# Altium schematic sheet RTU_LMG_CPU.SchDoc
size A2; Organization: Altium Limited; Address1: L3, 12a Rodborough Rd; Address2: Frenchs Forest; Address3: NSW; Address4: Australia 2086; SheetNumber: 2; SheetTotal: 16
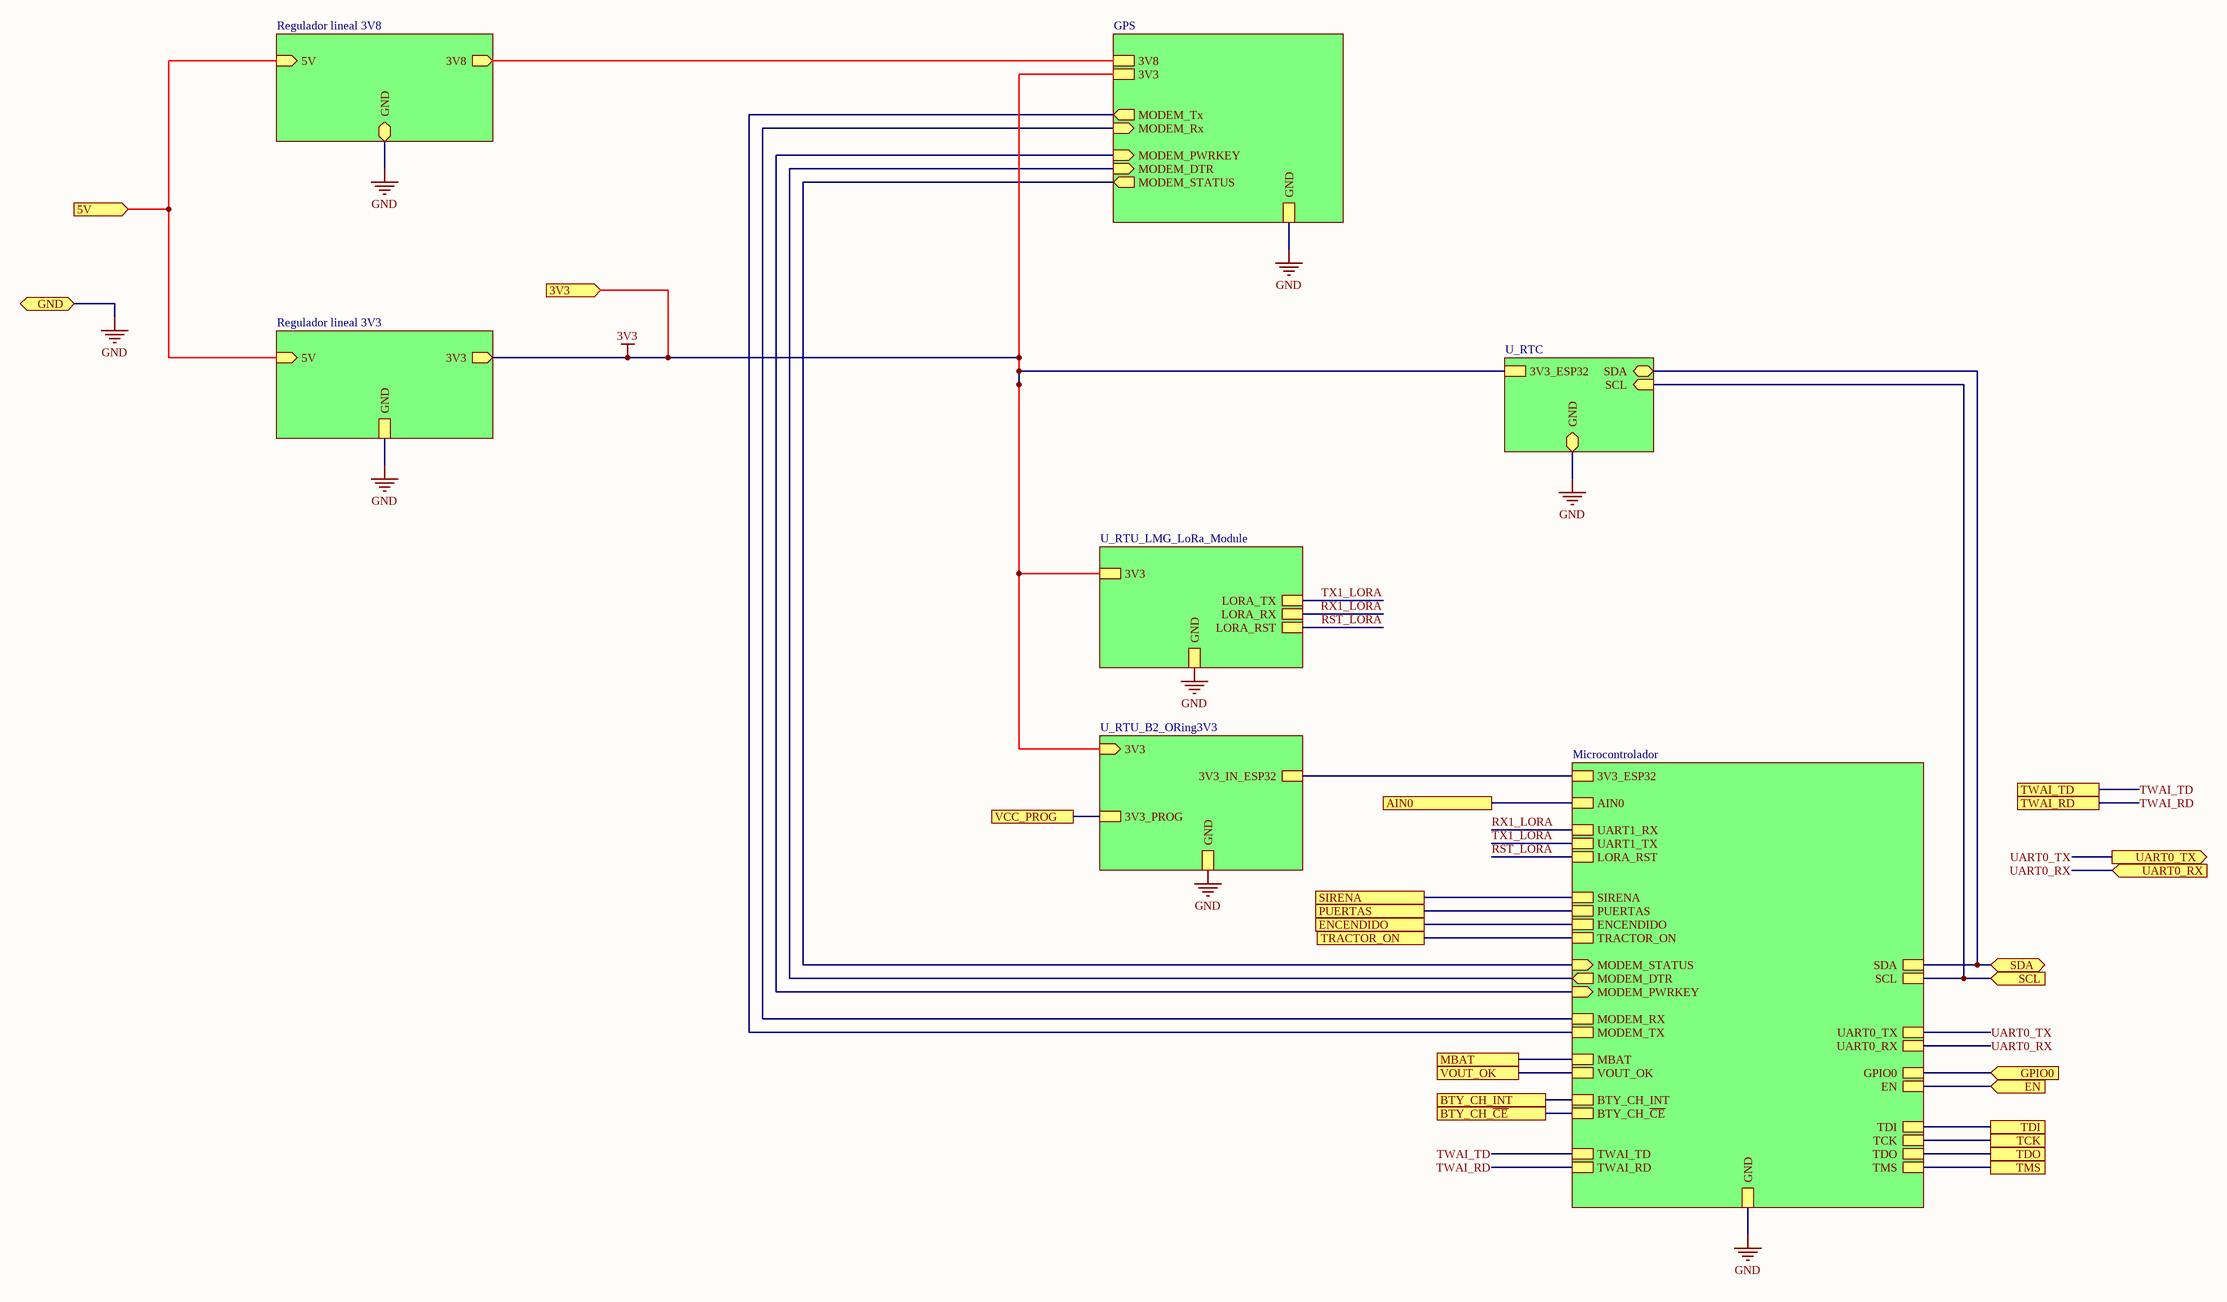
[diagram p0: RTU_LMG_CPU.SchDoc]

## Sub-sheets
GPS = RTU_LMG_Modem.SchDoc: 3V3, 3V8, GND, MODEM_Rx (in), MODEM_PWRKEY (in), MODEM_Tx (out), MODEM_DTR (in), MODEM_STATUS (out)
Microcontrolador = RTU_LMG_Microcontroller.SchDoc: MODEM_TX, EN, MODEM_RX, UART0_TX, UART0_RX, SDA, SCL, MODEM_DTR (out), MODEM_STATUS (in), GPIO0, GND, MODEM_PWRKEY (in), TDI, TCK, TDO, TMS, BTY_CH_INT, BTY_CH_~{CE}, VOUT_OK, MBAT, 3V3_ESP32, LORA_RST, UART1_TX, UART1_RX, TWAI_TD, TWAI_RD, SIRENA, PUERTAS, ENCENDIDO, TRACTOR_ON, AIN0
Regulador lineal 3V3 = RTU_LMG_Linear_Voltage_Regulator_3V3.SchDoc: GND, 3V3 (out), 5V (in)
Regulador lineal 3V8 = RTU_LMG_Linear_Voltage_Regulator_3V8.SchDoc: GND (bidir), 3V8 (out), 5V (in)
U_RTC = RTU_LMG_RTC.SchDoc: SDA (bidir), SCL (in), GND (bidir), 3V3_ESP32
U_RTU_B2_ORing3V3 = RTU_LMG_ORing3V3.SchDoc: 3V3_PROG, 3V3_IN_ESP32, GND, 3V3 (in)
U_RTU_LMG_LoRa_Module = RTU_LMG_LoRa_Module.SchDoc: LORA_RST, LORA_TX, LORA_RX, 3V3, GND

## Ports
3V3 (in), 5V (in), AIN0, BTY_CH_INT, BTY_CH_~{CE}, EN (in), ENCENDIDO, GND (bidir), GPIO0 (in), MBAT, PUERTAS, SCL (in), SDA (bidir), SIRENA, TCK, TDI, TDO, TMS, TRACTOR_ON, TWAI_RD, TWAI_TD, UART0_RX (in), UART0_TX (out), VCC_PROG, VOUT_OK

## Nets
3V3: port 3V3, sheet GPS/3V3, sheet Regulador lineal 3V3/3V3, sheet U_RTU_B2_ORing3V3/3V3, sheet U_RTC/3V3_ESP32, sheet U_RTU_LMG_LoRa_Module/3V3
GND: port GND, sheet Microcontrolador/GND, sheet GPS/GND, sheet Regulador lineal 3V3/GND, sheet Regulador lineal 3V8/GND, sheet U_RTU_B2_ORing3V3/GND, sheet U_RTC/GND, sheet U_RTU_LMG_LoRa_Module/GND
5V: port 5V, sheet Regulador lineal 3V3/5V, sheet Regulador lineal 3V8/5V
AIN0: port AIN0, sheet Microcontrolador/AIN0
BTY_CH_~{CE}: port BTY_CH_~{CE}, sheet Microcontrolador/BTY_CH_~{CE}
BTY_CH_INT: port BTY_CH_INT, sheet Microcontrolador/BTY_CH_INT
EN: port EN, sheet Microcontrolador/EN
ENCENDIDO: port ENCENDIDO, sheet Microcontrolador/ENCENDIDO
GPIO0: port GPIO0, sheet Microcontrolador/GPIO0
MBAT: port MBAT, sheet Microcontrolador/MBAT
PUERTAS: port PUERTAS, sheet Microcontrolador/PUERTAS
RST_LORA: sheet Microcontrolador/LORA_RST, sheet U_RTU_LMG_LoRa_Module/LORA_RST
RX1_LORA: sheet Microcontrolador/UART1_RX, sheet U_RTU_LMG_LoRa_Module/LORA_RX
SCL: port SCL, sheet Microcontrolador/SCL, sheet U_RTC/SCL
SDA: port SDA, sheet Microcontrolador/SDA, sheet U_RTC/SDA
SIRENA: port SIRENA, sheet Microcontrolador/SIRENA
TCK: port TCK, sheet Microcontrolador/TCK
TDI: port TDI, sheet Microcontrolador/TDI
TDO: port TDO, sheet Microcontrolador/TDO
TMS: port TMS, sheet Microcontrolador/TMS
TRACTOR_ON: port TRACTOR_ON, sheet Microcontrolador/TRACTOR_ON
TWAI_RD: port TWAI_RD, sheet Microcontrolador/TWAI_RD
TWAI_TD: port TWAI_TD, sheet Microcontrolador/TWAI_TD
TX1_LORA: sheet Microcontrolador/UART1_TX, sheet U_RTU_LMG_LoRa_Module/LORA_TX
UART0_RX: port UART0_RX, sheet Microcontrolador/UART0_RX
UART0_TX: port UART0_TX, sheet Microcontrolador/UART0_TX
VCC_PROG: port VCC_PROG, sheet U_RTU_B2_ORing3V3/3V3_PROG
VOUT_OK: port VOUT_OK, sheet Microcontrolador/VOUT_OK
(unnamed): sheet Microcontrolador/MODEM_TX, sheet GPS/MODEM_Tx
(unnamed): sheet Microcontrolador/MODEM_RX, sheet GPS/MODEM_Rx
(unnamed): sheet Microcontrolador/MODEM_DTR, sheet GPS/MODEM_DTR
(unnamed): sheet Microcontrolador/MODEM_STATUS, sheet GPS/MODEM_STATUS
(unnamed): sheet Microcontrolador/MODEM_PWRKEY, sheet GPS/MODEM_PWRKEY
(unnamed): sheet Microcontrolador/3V3_ESP32, sheet U_RTU_B2_ORing3V3/3V3_IN_ESP32
(unnamed): sheet GPS/3V8, sheet Regulador lineal 3V8/3V8

## Notes on the sheet
- Title
- Size:
- Date:
- File:
- A2
- Number:
- Time:
- Revision:
- Sheet
- of